# Altium project WUB.PrjPcb
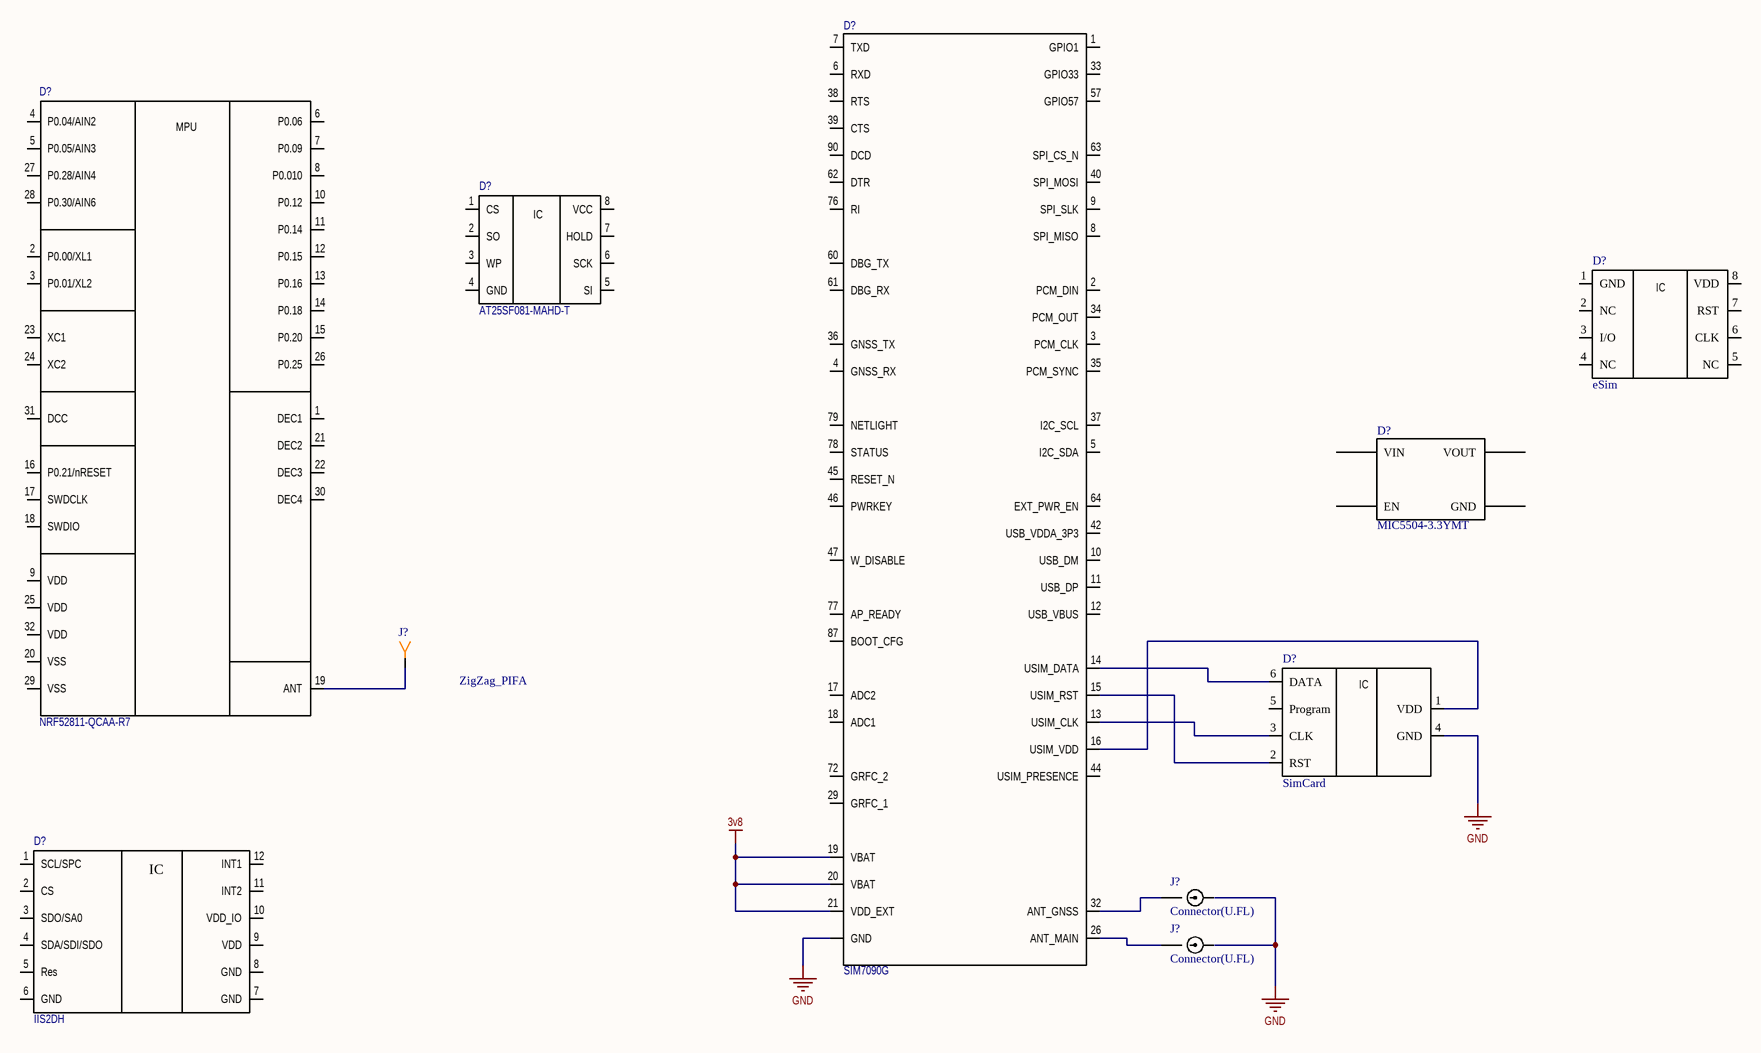
[diagram p0: Sheet1.SchDoc]
1 sheet, 10 parts. Net scope: global (net labels, ports and power ports of the same name join across sheets).
Board file: PCB1.PcbDoc

## Sheet Sheet1.SchDoc
size A1

### Parts
D1  SIM7090G  [SIM7090G]
D2  NRF52811-QCAA-R7  [QFN32_nrf52811]
D3  AT25SF081-MAHD-T  [UDFN8]
D4  eSim  [VQFN8]
D5  MIC5504-3.3YMT  [TDFN4]
D6  SimCard  [104224-0820]
D7  IIS2DH  [LGA12]
J1  ZigZag_PIFA  [ZigZag_PIFA]
J2  Connector(U.FL)  [U.FL]
J3  Connector(U.FL)  [U.FL]

### Nets
3v8: D1.19(VBAT) D1.20(VBAT) D1.21(VDD_EXT)
GND: D1.22(GND) D1.23(GND) D1.24(GND) D1.25(GND) D1.27(GND) D1.28(GND) D1.30(GND) D1.31(GND) D1.43(GND) D1.52(GND) D1.53(GND) D1.54(GND) D1.55(GND) D1.56(GND) D1.58(GND) D1.65(GND) D1.66(GND) D1.73(GND) D1.74(GND) D1.75(GND) D1.84(GND) D1.85(GND) D1.86(GND) D1.88(GND) D1.89(GND) D6.4(GND)
NetD1_13: D1.13(USIM_CLK) D6.3(CLK)
NetD1_14: D1.14(USIM_DATA) D6.6(DATA)
NetD1_15: D1.15(USIM_RST) D6.2(RST)
NetD1_16: D1.16(USIM_VDD) D6.1(VDD)
NetD1_26: D1.26(ANT_MAIN) J3.1
NetD1_32: D1.32(ANT_GNSS) J2.1
NetD2_19: D2.19(ANT) J1.1

Not connected (* = marked no-connect by the designer): D1 1(GPIO1) 2(PCM_DIN) 3(PCM_CLK) 4(GNSS_RX) 5(I2C_SDA) 6(RXD) 7(TXD) 8(SPI_MISO) 9(SPI_SLK) 10(USB_DM) 11(USB_DP) 12(USB_VBUS) 17(ADC2) 18(ADC1) 29(GRFC_1) 33(GPIO33) 34(PCM_OUT) 35(PCM_SYNC) 36(GNSS_TX) 37(I2C_SCL) 38(RTS) 39(CTS) 40(SPI_MOSI) 42(USB_VDDA_3P3) 44(USIM_PRESENCE) 45(RESET_N) 46(PWRKEY) 47(W_DISABLE) 57(GPIO57) 60(DBG_TX) 61(DBG_RX) 62(DTR) 63(SPI_CS_N) 64(EXT_PWR_EN) 72(GRFC_2) 76(RI) 77(AP_READY) 78(STATUS) 79(NETLIGHT) 87(BOOT_CFG) 90(DCD); D2 1(DEC1) 2(P0.00/XL1) 3(P0.01/XL2) 4(P0.04/AIN2) 5(P0.05/AIN3) 6(P0.06) 7(P0.09) 8(P0.010) 9(VDD) 10(P0.12) 11(P0.14) 12(P0.15) 13(P0.16) 14(P0.18) 15(P0.20) 16(P0.21/nRESET) 17(SWDCLK) 18(SWDIO) 20(VSS) 21(DEC2) 22(DEC3) 23(XC1) 24(XC2) 25(VDD) 26(P0.25) 27(P0.28/AIN4) 28(P0.30/AIN6) 29(VSS) 30(DEC4) 31(DCC) 32(VDD); D3 1(CS) 2(SO) 3(WP) 4(GND) 5(SI) 6(SCK) 7(HOLD) 8(VCC); D4 1(GND) 2(NC) 3(I/O) 4(NC) 5(NC) 6(CLK) 7(RST) 8(VDD); D5 1(VOUT) 2(GND) 3(EN) 4(VIN); D6 5(Program); D7 1(SCL/SPC) 2(CS) 3(SDO/SA0) 4(SDA/SDI/SDO) 5(Res) 6(GND) 7(GND) 8(GND) 9(VDD) 10(VDD_IO) 11(INT2) 12(INT1); J2 2; J3 2

### Notes on the sheet
- (in symbol AT25SF081-MAHD-T) IC
- (in symbol eSim) IC
- (in symbol IIS2DH) IC
- (in symbol NRF52811-QCAA-R7) MPU
- (in symbol SimCard) IC